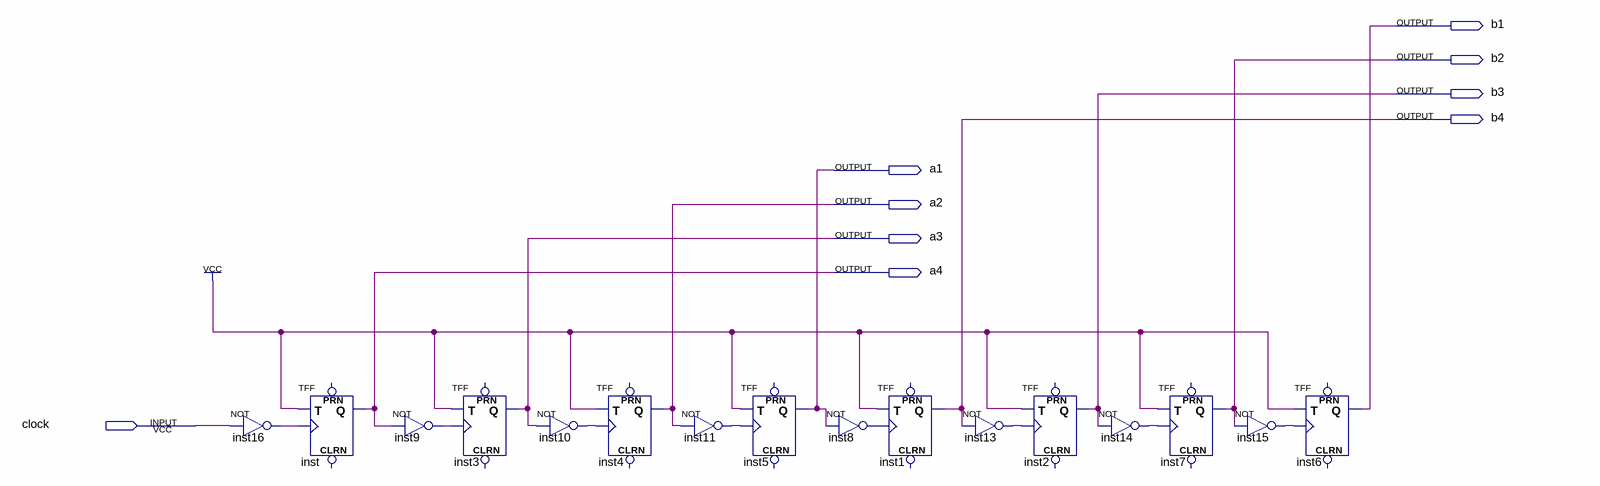
[diagram p0: schematic sheet]
// Quartus schematic EightBitCounter.bdf as structural Verilog: 16 symbols, 9 pins
module EightBitCounter (
  input  clock,
  output b1,
  output b2,
  output b3,
  output b4,
  output a1,
  output a2,
  output a3,
  output a4
);

  wire inst8_out, inst9_out, inst10_out, inst11_out, inst13_out, inst14_out, inst15_out, inst16_out;

  not inst16 (inst16_out, clock);
  TFF inst (.T(1'b1), .CLK(inst16_out), .Q(a4));  // open: PRN, CLRN
  not inst9 (inst9_out, a4);
  TFF inst3 (.T(1'b1), .CLK(inst9_out), .Q(a3));  // open: PRN, CLRN
  not inst10 (inst10_out, a3);
  TFF inst4 (.T(1'b1), .CLK(inst10_out), .Q(a2));  // open: PRN, CLRN
  not inst11 (inst11_out, a2);
  TFF inst5 (.T(1'b1), .CLK(inst11_out), .Q(a1));  // open: PRN, CLRN
  not inst8 (inst8_out, a1);
  TFF inst1 (.T(1'b1), .CLK(inst8_out), .Q(b4));  // open: PRN, CLRN
  not inst13 (inst13_out, b4);
  TFF inst2 (.T(1'b1), .CLK(inst13_out), .Q(b3));  // open: PRN, CLRN
  not inst14 (inst14_out, b3);
  TFF inst7 (.T(1'b1), .CLK(inst14_out), .Q(b2));  // open: PRN, CLRN
  not inst15 (inst15_out, b2);
  TFF inst6 (.T(1'b1), .CLK(inst15_out), .Q(b1));  // open: PRN, CLRN
endmodule
